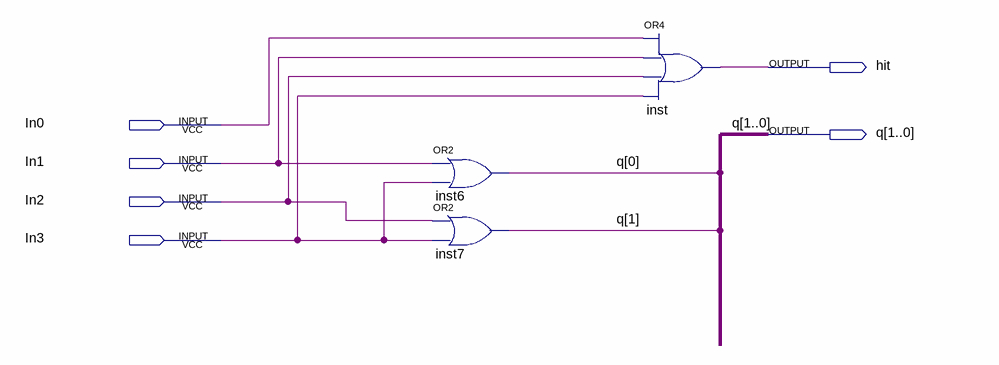
[diagram p0: schematic sheet]
// Quartus schematic Encoder.bdf as structural Verilog: 3 symbols, 6 pins
module Encoder (
  input  In0,
  input  In1,
  input  In2,
  input  In3,
  output hit,
  output [1:0] q
);

  or inst6 (q[0], In1, In3);
  or inst7 (q[1], In2, In3);
  or inst (hit, In0, In1, In2, In3);
endmodule
